# Altium schematic sheet GMSL_DESERIALIZER.SchDoc
size D; SheetNumber: 11; SheetTotal: 22
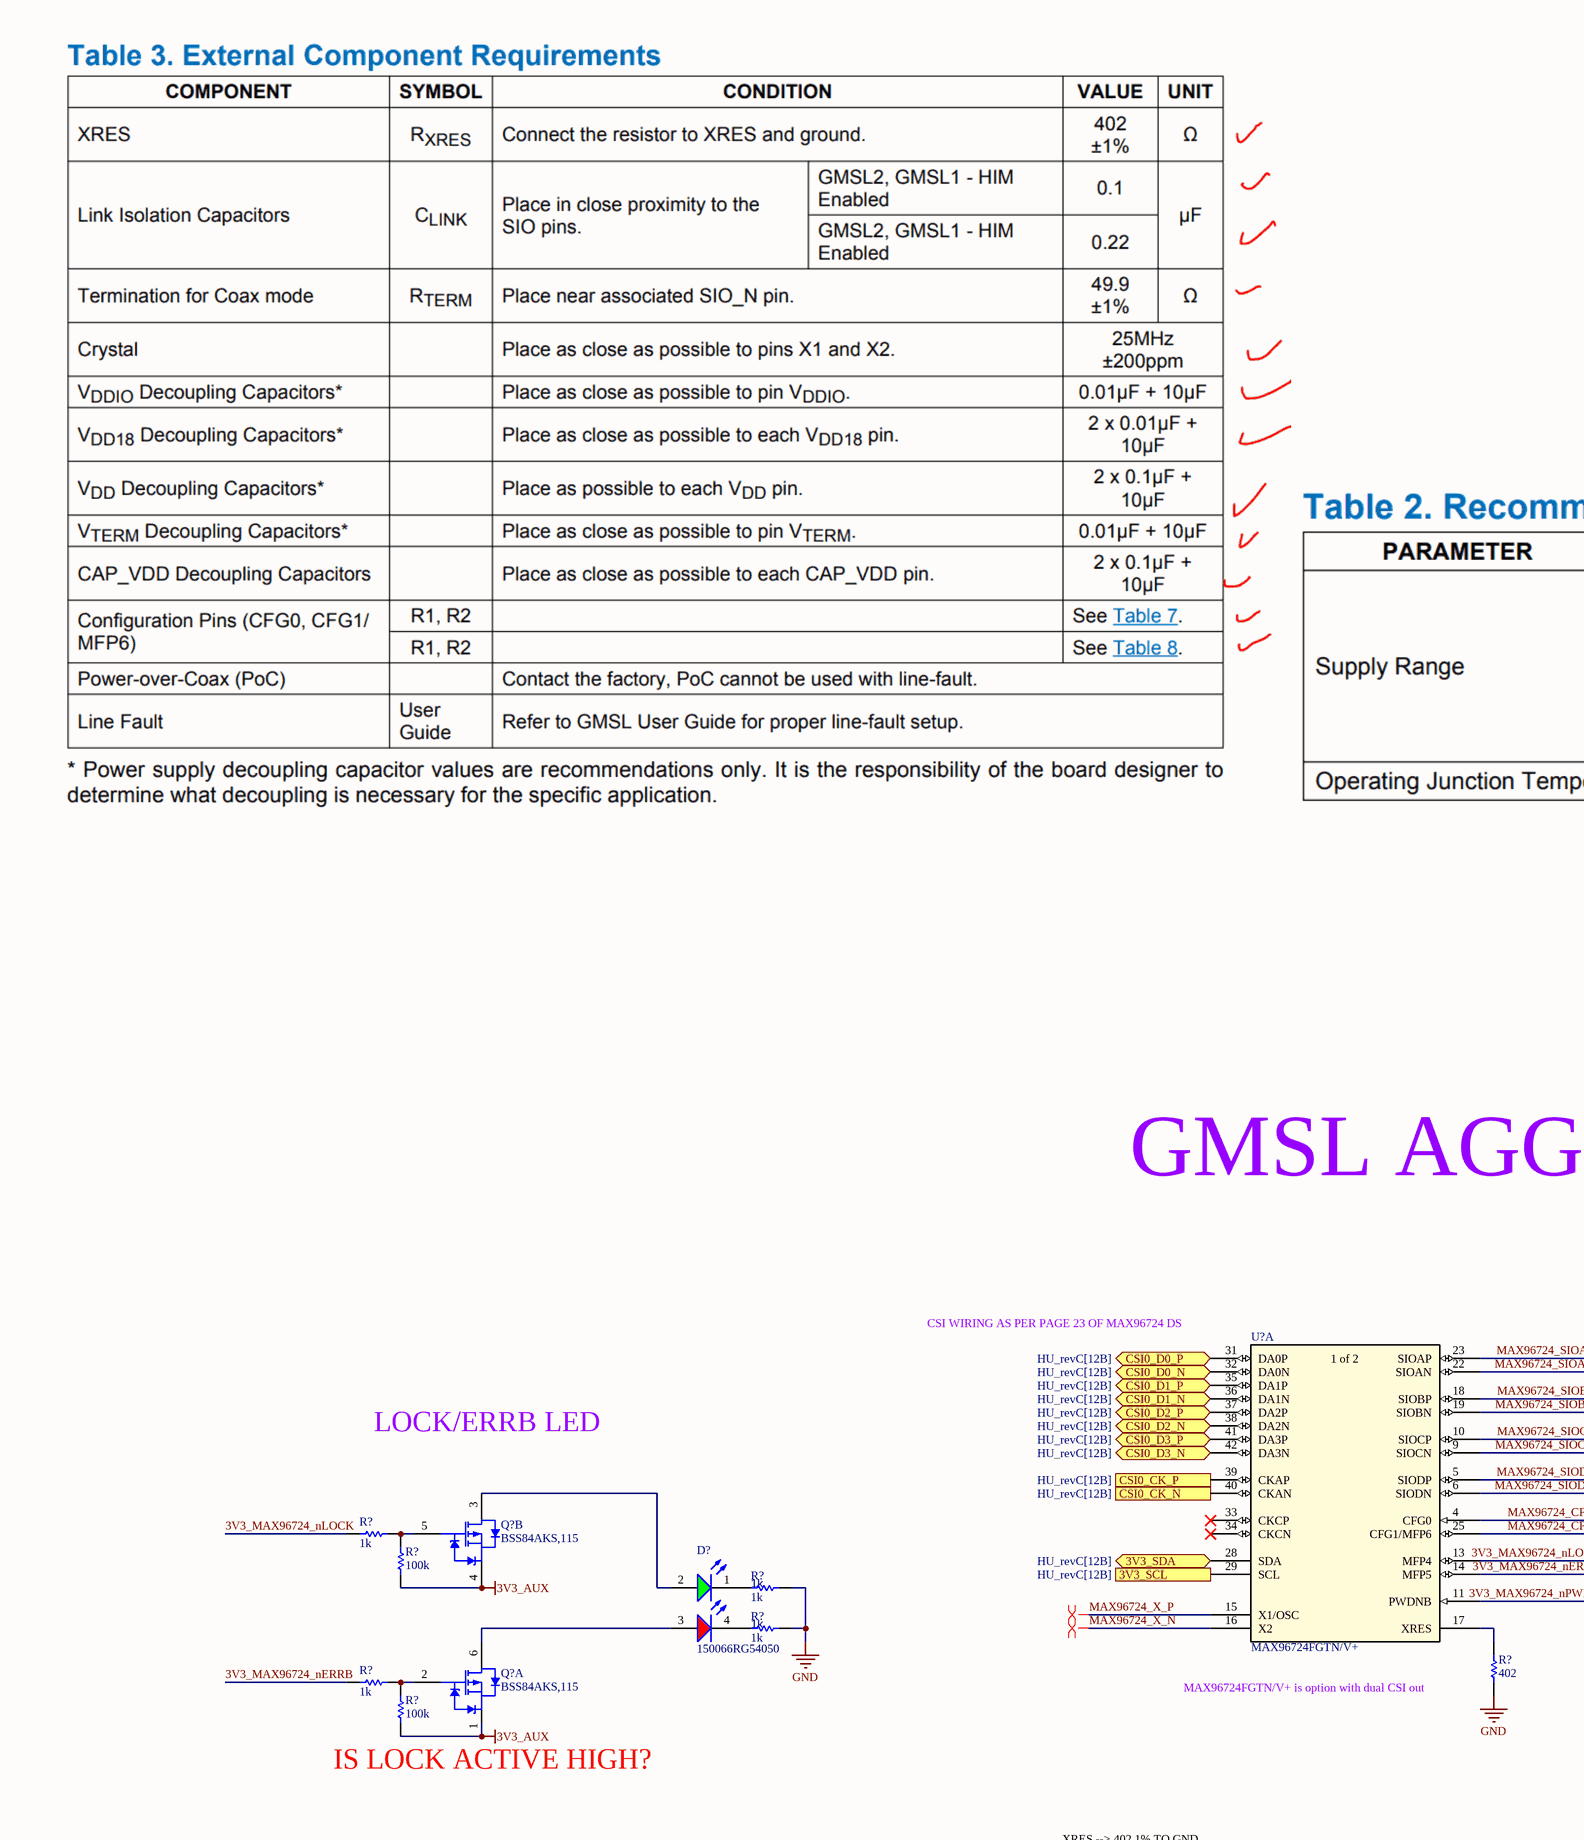
[diagram p0: GMSL_DESERIALIZER.SchDoc, top left]
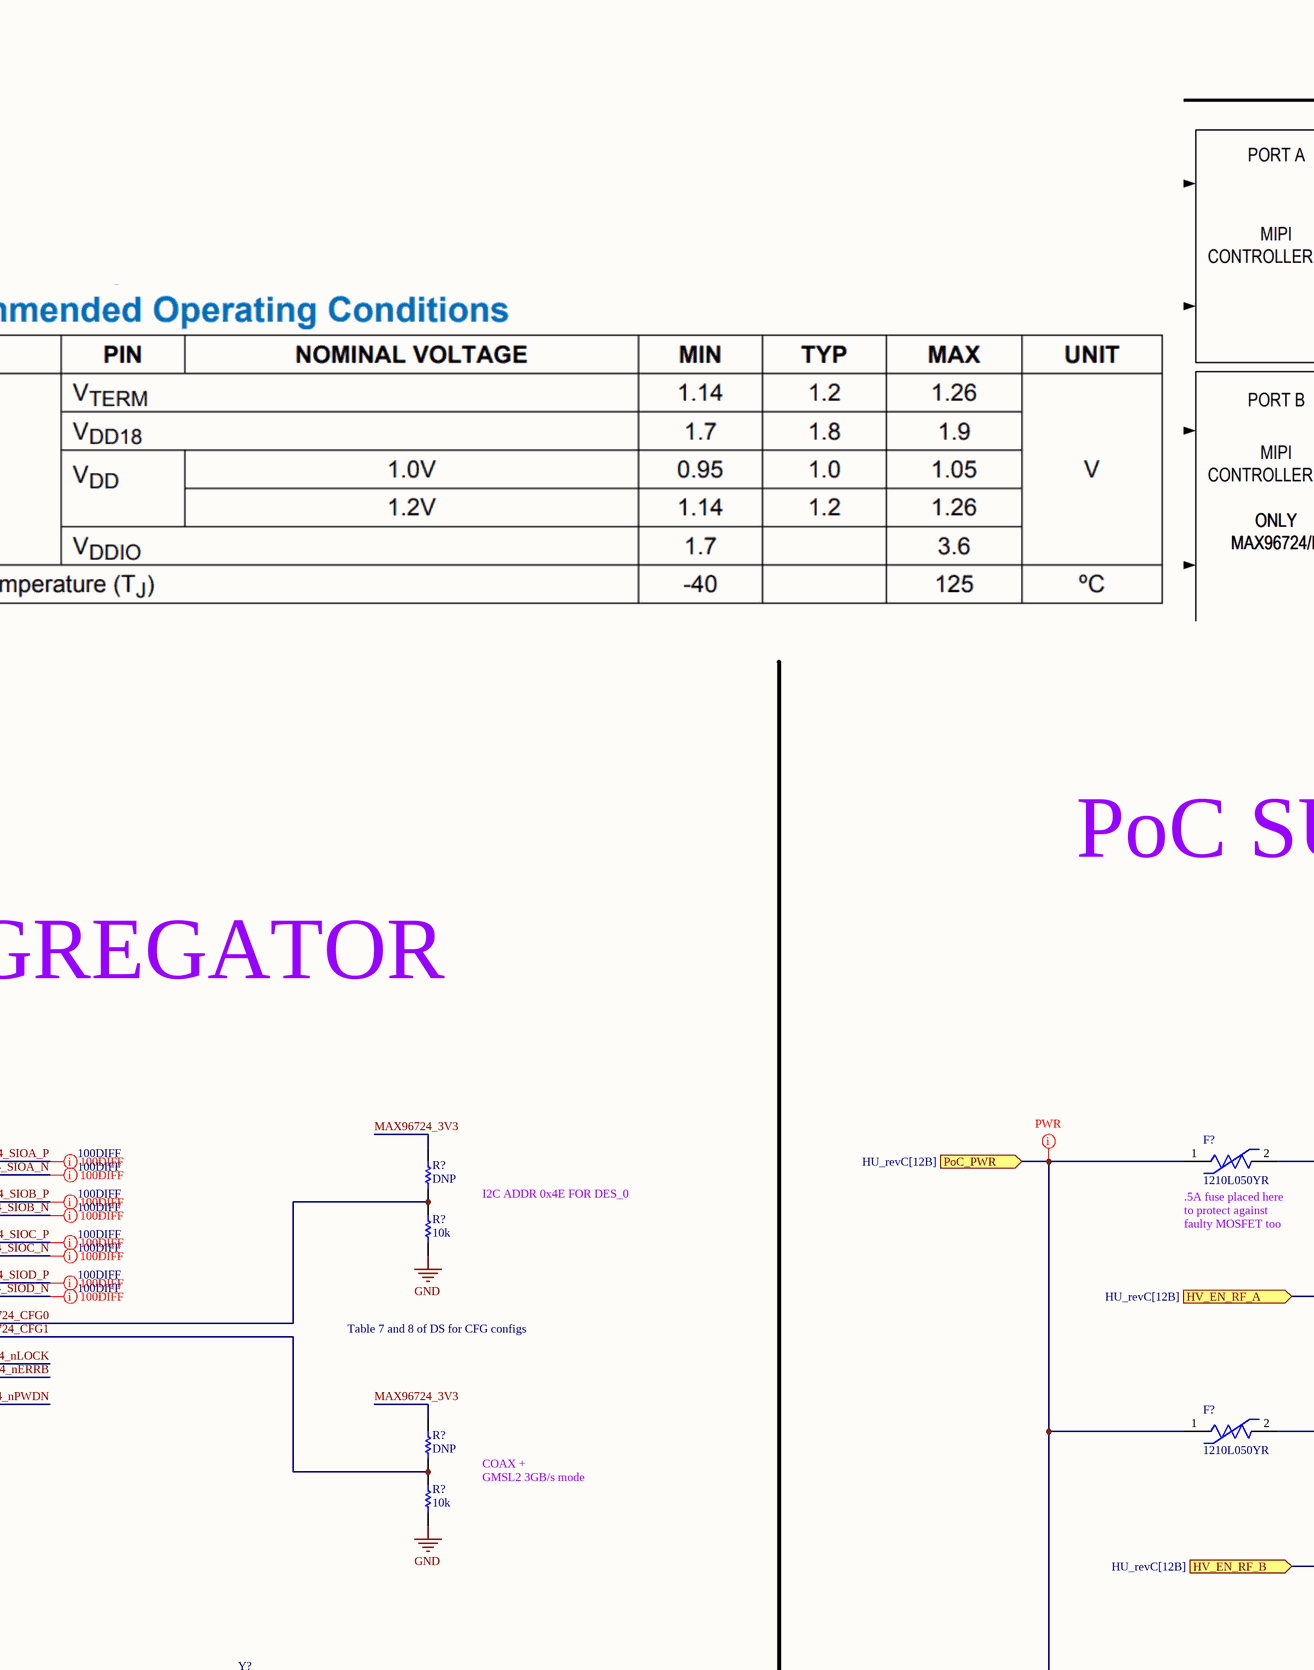
[diagram p1: GMSL_DESERIALIZER.SchDoc, top middle]
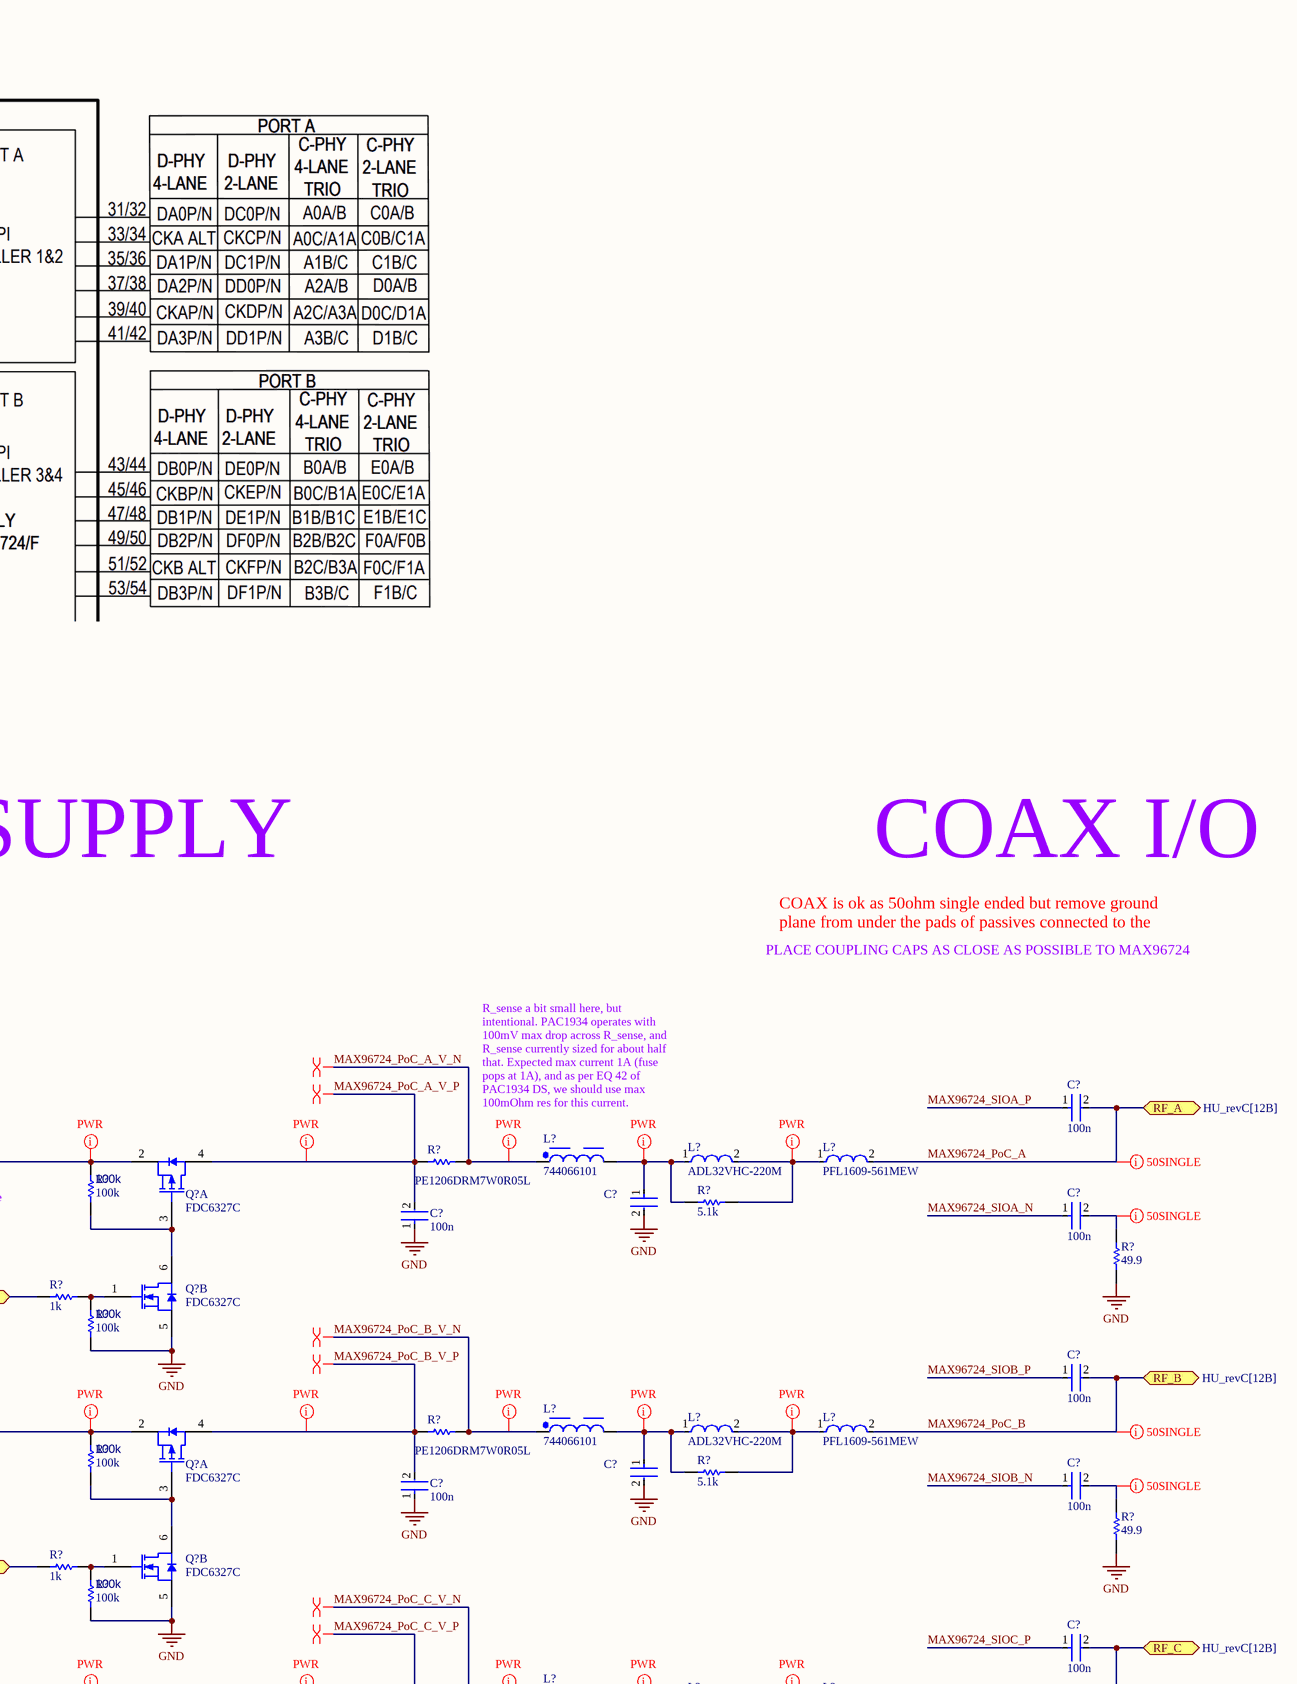
[diagram p2: GMSL_DESERIALIZER.SchDoc, top right]
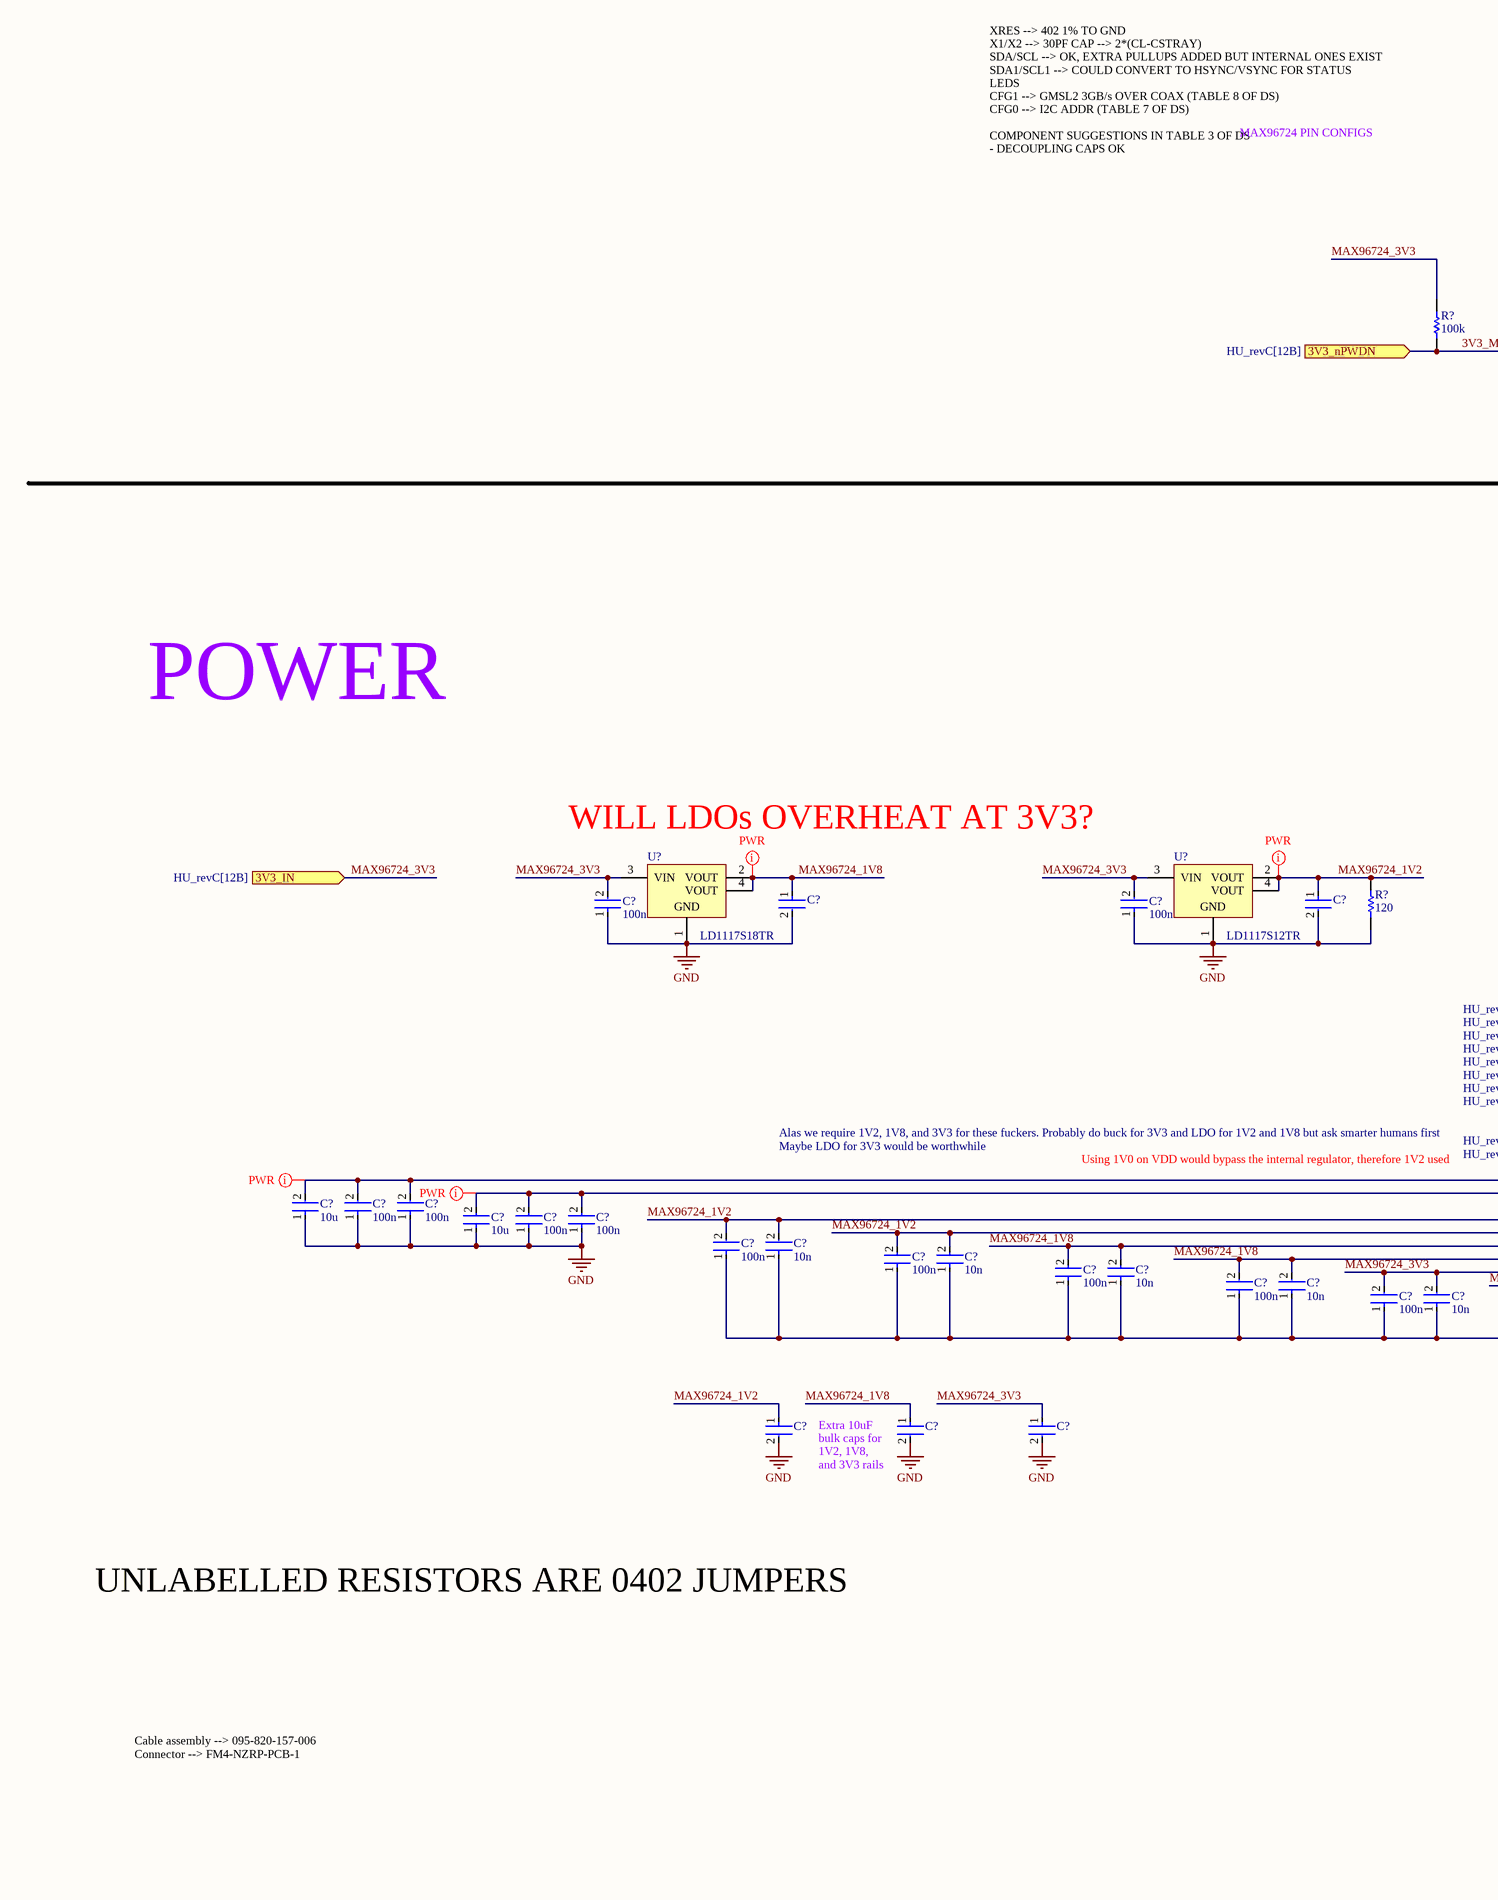
[diagram p3: GMSL_DESERIALIZER.SchDoc, bottom left]
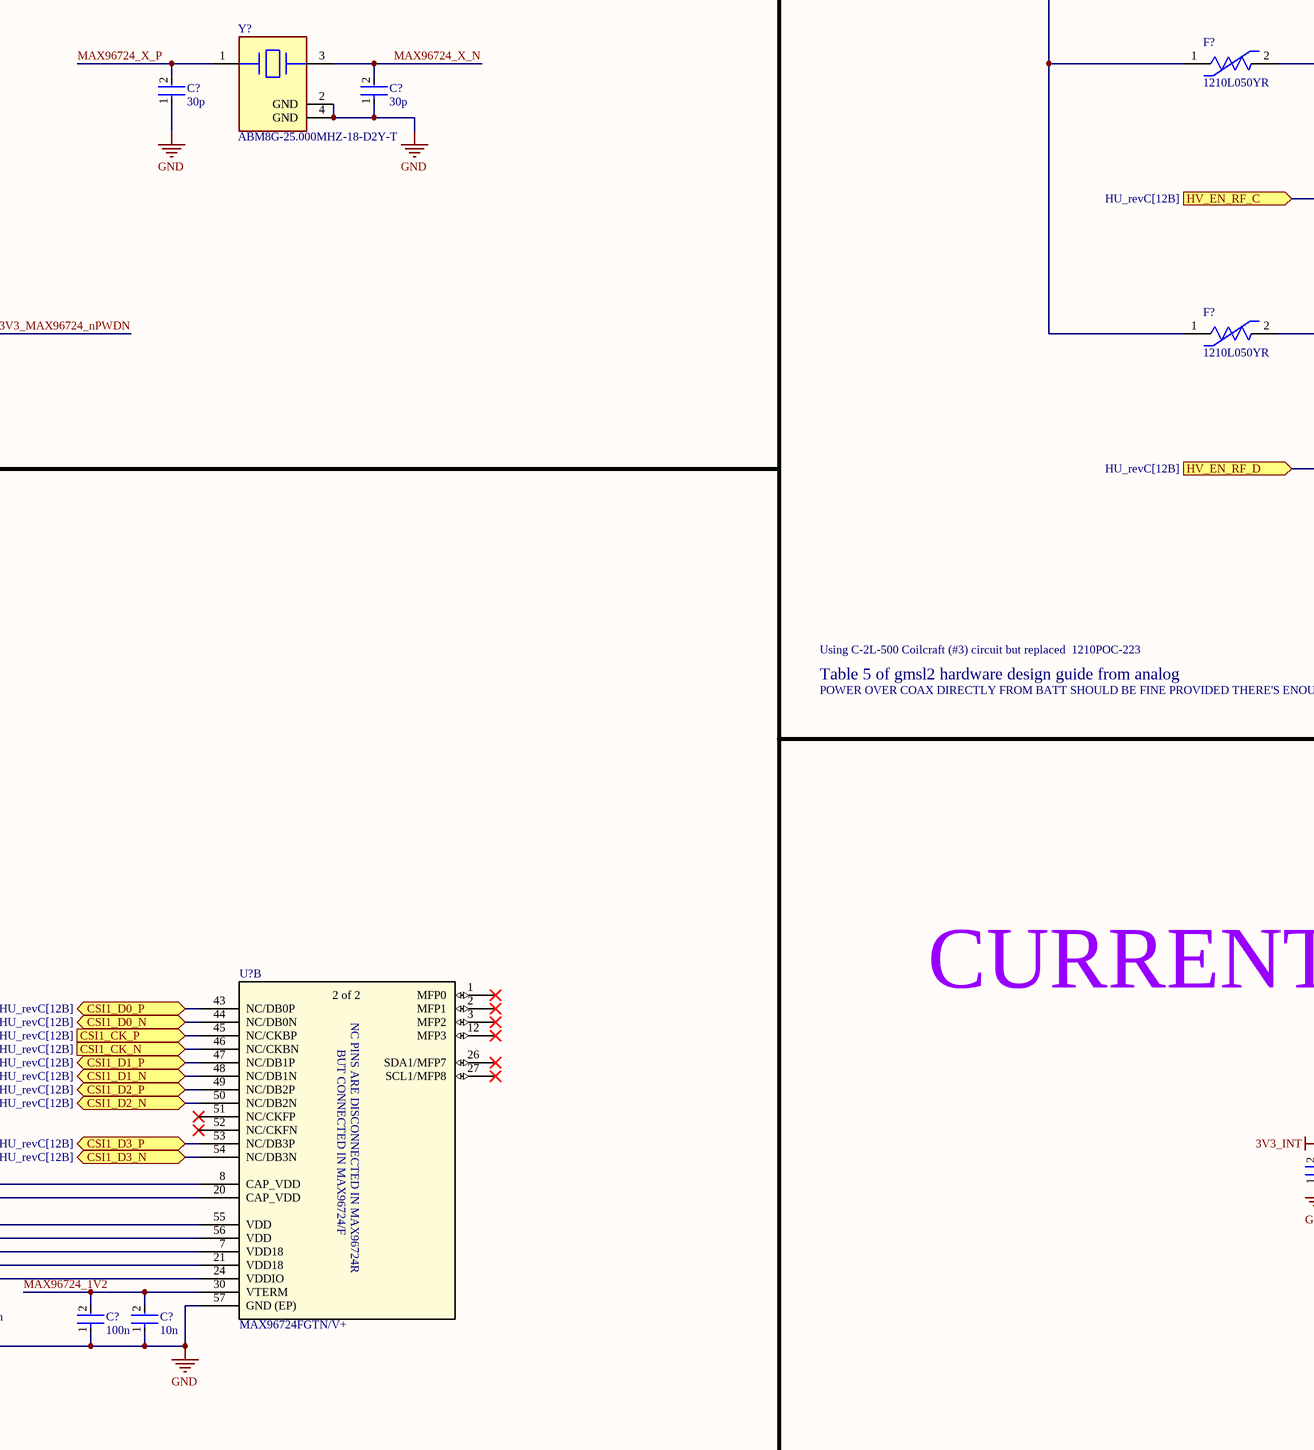
[diagram p4: GMSL_DESERIALIZER.SchDoc, bottom middle]
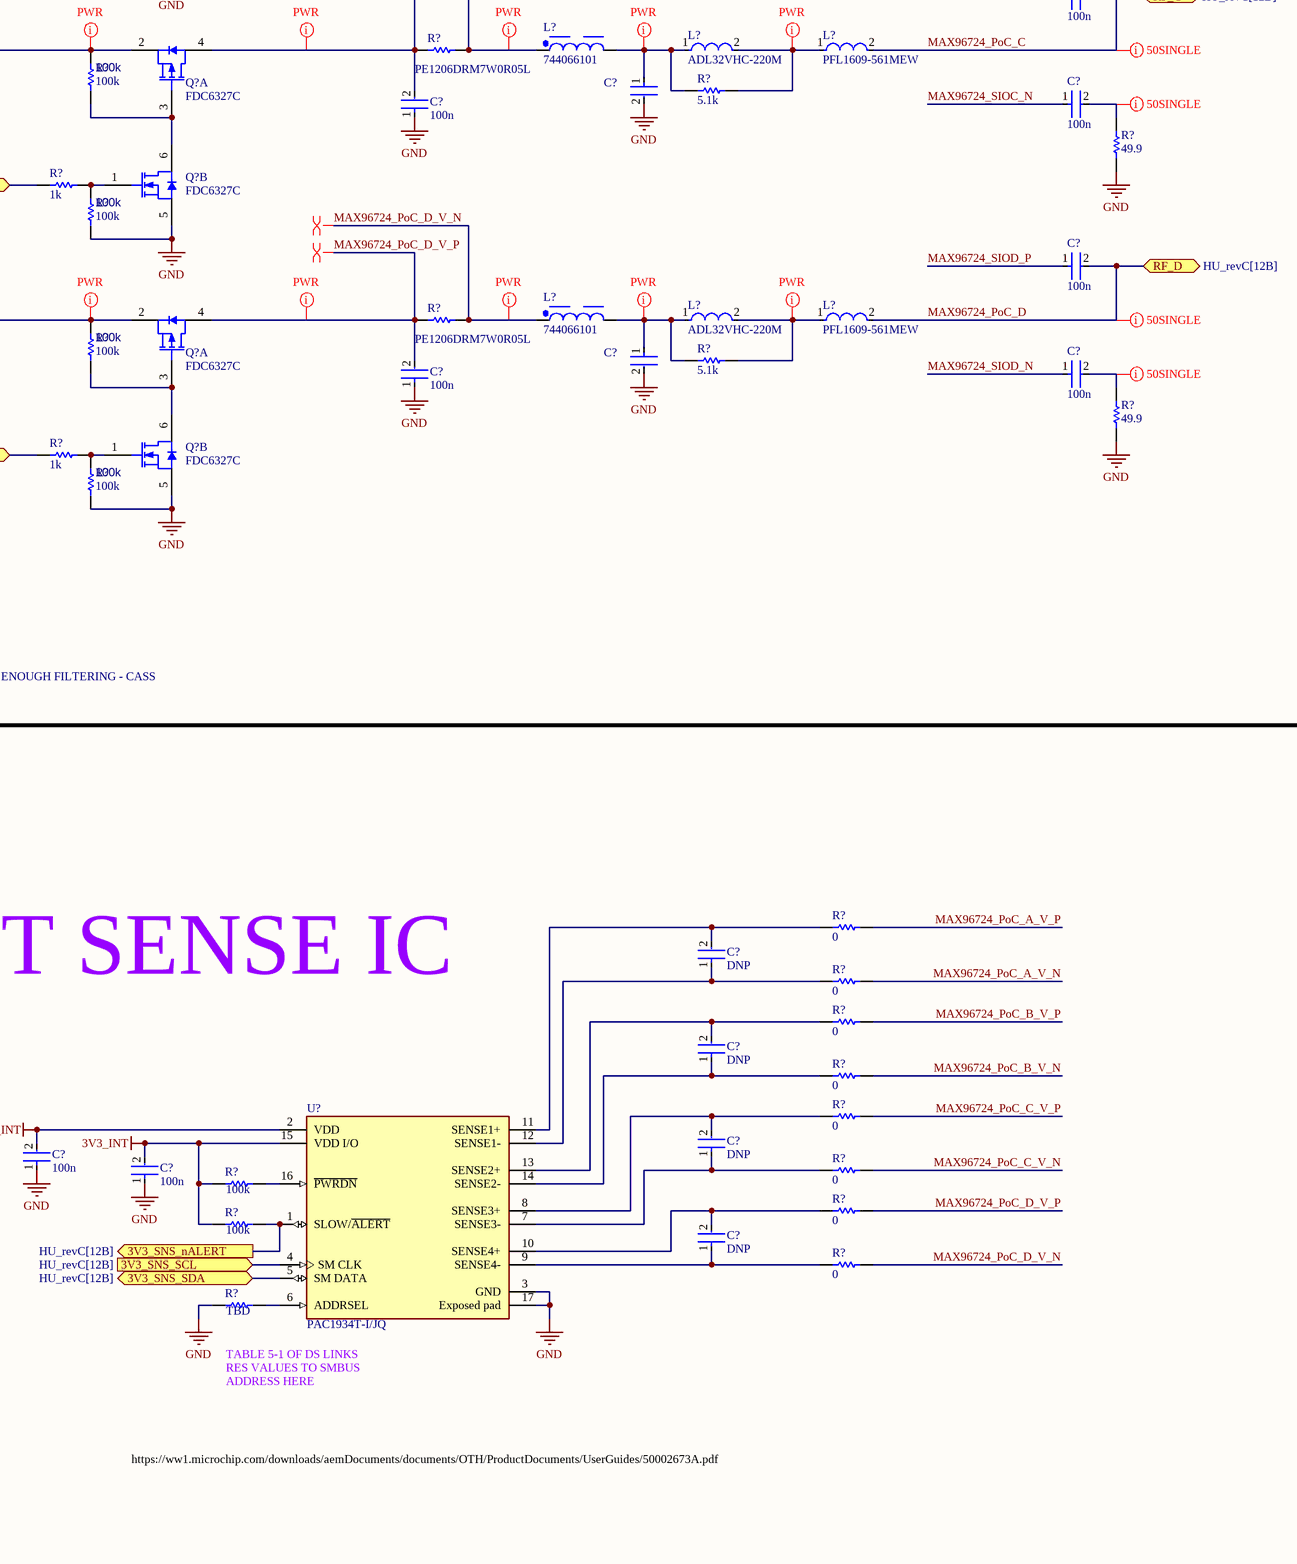
[diagram p5: GMSL_DESERIALIZER.SchDoc, bottom right]

## Parts
(Parts that share a designator on the sheet are numbered #1, #2 ... from top to bottom, then left to right.)
C?#1  100n  [FP-0402-L_1_0_0_05-W_0_5-IPC_A]
C?#2  GRM21BR61E226ME44L  [FP-GRM21B-0_2-e0_2_0_7-IPC_B]  (value not drawn)
C?#3  100n  [FP-0402-L_1_0_0_05-W_0_5-IPC_A]
C?#4  100n  [FP-0402-L_1_0_0_05-W_0_5-IPC_A]
C?#5  100n  [FP-0402-L_1_0_0_05-W_0_5-IPC_A]
C?#6  GRM21BR61E226ME44L  [FP-GRM21B-0_2-e0_2_0_7-IPC_B]  (value not drawn)
C?#7  100n  [FP-0402-L_1_0_0_05-W_0_5-IPC_A]
C?#8  100n  [FP-0402-L_1_0_0_05-W_0_5-IPC_A]
C?#9  100n  [FP-0402-L_1_0_0_05-W_0_5-IPC_A]
C?#10  GRM21BR61E226ME44L  [FP-GRM21B-0_2-e0_2_0_7-IPC_B]  (value not drawn)
C?#11  30p  [FP-0402-L_1_0_0_05-W_0_5-IPC_A]
C?#12  30p  [FP-0402-L_1_0_0_05-W_0_5-IPC_A]
C?#13  100n  [FP-0402-L_1_0_0_05-W_0_5-IPC_A]
C?#14  100n  [FP-0402-L_1_0_0_05-W_0_5-IPC_A]
C?#15  100n  [FP-0402-L_1_0_0_05-W_0_5-IPC_A]
C?#16  GRM21BR61E226ME44L  [FP-GRM21B-0_2-e0_2_0_7-IPC_B]  (value not drawn)
C?#17  100n  [FP-0402-L_1_0_0_05-W_0_5-IPC_A]
C?#18  100n  [FP-0402-L_1_0_0_05-W_0_5-IPC_A]
C?#19  GRM188R60J106ME47D  [FP-GRM188-0_1-e0_2_0_55-IPC_A]  (value not drawn)
C?#20  GRM188R60J106ME47D  [FP-GRM188-0_1-e0_2_0_55-IPC_A]  (value not drawn)
C?#21  100n  [FP-0402-L_1_0_0_05-W_0_5-IPC_A]
C?#22  100n  [FP-0402-L_1_0_0_05-W_0_5-IPC_A]
C?#23  DNP  [FP-0402-L_1_0_0_05-W_0_5-IPC_A]
C?#24  DNP  [FP-0402-L_1_0_0_05-W_0_5-IPC_A]
C?#25  DNP  [FP-0402-L_1_0_0_05-W_0_5-IPC_A]
C?#26  100n  [FP-0402-L_1_0_0_05-W_0_5-IPC_A]
C?#27  100n  [FP-0402-L_1_0_0_05-W_0_5-IPC_A]
C?#28  10u  [FP-0402-L_1_0_0_05-W_0_5-IPC_A]
C?#29  100n  [FP-0402-L_1_0_0_05-W_0_5-IPC_A]
C?#30  100n  [FP-0402-L_1_0_0_05-W_0_5-IPC_A]
C?#31  10u  [FP-0402-L_1_0_0_05-W_0_5-IPC_A]
C?#32  100n  [FP-0402-L_1_0_0_05-W_0_5-IPC_A]
C?#33  100n  [FP-0402-L_1_0_0_05-W_0_5-IPC_A]
C?#34  100n  [FP-0402-L_1_0_0_05-W_0_5-IPC_A]
C?#35  10n  [FP-0402-L_1_0_0_05-W_0_5-IPC_A]
C?#36  DNP  [FP-0402-L_1_0_0_05-W_0_5-IPC_A]
C?#37  100n  [FP-0402-L_1_0_0_05-W_0_5-IPC_A]
C?#38  10n  [FP-0402-L_1_0_0_05-W_0_5-IPC_A]
C?#39  100n  [FP-0402-L_1_0_0_05-W_0_5-IPC_A]
C?#40  10n  [FP-0402-L_1_0_0_05-W_0_5-IPC_A]
C?#41  100n  [FP-0402-L_1_0_0_05-W_0_5-IPC_A]
C?#42  10n  [FP-0402-L_1_0_0_05-W_0_5-IPC_A]
C?#43  100n  [FP-0402-L_1_0_0_05-W_0_5-IPC_A]
C?#44  10n  [FP-0402-L_1_0_0_05-W_0_5-IPC_A]
C?#45  100n  [FP-0402-L_1_0_0_05-W_0_5-IPC_A]
C?#46  10n  [FP-0402-L_1_0_0_05-W_0_5-IPC_A]
C?#47  EMK107BBJ106MA-T  [FP-0603-L_1_6_0_2-W_0_8_0-MFG]  (value not drawn)
C?#48  EMK107BBJ106MA-T  [FP-0603-L_1_6_0_2-W_0_8_0-MFG]  (value not drawn)
C?#49  EMK107BBJ106MA-T  [FP-0603-L_1_6_0_2-W_0_8_0-MFG]  (value not drawn)
D?  150066RG54050  [WL-SBCD_0606]
F?#1  1210L050YR  [FP-1210L050YR-MFG]
F?#2  1210L050YR  [FP-1210L050YR-MFG]
F?#3  1210L050YR  [FP-1210L050YR-MFG]
F?#4  1210L050YR  [FP-1210L050YR-MFG]
L?#1  744066101  [WE-TPC_1038]
L?#2  ADL32VHC-220M  [FP-1210POC-MFG]
L?#3  PFL1609-561MEW  [FP-PFL1609-MFG]
L?#4  744066101  [WE-TPC_1038]
L?#5  ADL32VHC-220M  [FP-1210POC-MFG]
L?#6  PFL1609-561MEW  [FP-PFL1609-MFG]
L?#7  744066101  [WE-TPC_1038]
L?#8  ADL32VHC-220M  [FP-1210POC-MFG]
L?#9  PFL1609-561MEW  [FP-PFL1609-MFG]
L?#10  744066101  [WE-TPC_1038]
L?#11  ADL32VHC-220M  [FP-1210POC-MFG]
L?#12  PFL1609-561MEW  [FP-PFL1609-MFG]
Q?#1  FDC6327C  [FAIR-SOT23-6_V]  (part A of 2)
Q?#2  FDC6327C  [FAIR-SOT23-6_V]  (part B of 2)
Q?#3  BSS84AKS,115  [NXP-SOT363_L]  (part B of 2)
Q?#4  BSS84AKS,115  [NXP-SOT363_L]  (part A of 2)
Q?#5  FDC6327C  [FAIR-SOT23-6_V]  (part A of 2)
Q?#6  FDC6327C  [FAIR-SOT23-6_V]  (part B of 2)
Q?#7  FDC6327C  [FAIR-SOT23-6_V]  (part A of 2)
Q?#8  FDC6327C  [FAIR-SOT23-6_V]  (part B of 2)
Q?#9  FDC6327C  [FAIR-SOT23-6_V]  (part A of 2)
Q?#10  FDC6327C  [FAIR-SOT23-6_V]  (part B of 2)
R?#1  PE1206DRM7W0R05L  [R1206B]
R?#2  DNP  [R0603B]
R?#3  100k  [R0603B]
R?#4  5.1k  [R0603B]
R?#5  10k  [R0603B]
R?#6  49.9  [R0603B]
R?#7  1k  [R0603B]
R?#8  100k  [R0603B]
R?#9  1k  [R0603B]
R?#10  100k  [R0603B]
R?#11  1k  [R0603B]
R?#12  1k  [R0603B]
R?#13  PE1206DRM7W0R05L  [R1206B]
R?#14  DNP  [R0603B]
R?#15  100k  [R0603B]
R?#16  402  [R0603B]
R?#17  5.1k  [R0603B]
R?#18  1k  [R0603B]
R?#19  10k  [R0603B]
R?#20  100k  [R0603B]
R?#21  49.9  [R0603B]
R?#22  1k  [R0603B]
R?#23  100k  [R0603B]
R?#24  PE1206DRM7W0R05L  [R1206B]
R?#25  100k  [R0603B]
R?#26  5.1k  [R0603B]
R?#27  49.9  [R0603B]
R?#28  1k  [R0603B]
R?#29  100k  [R0603B]
R?#30  100k  [R0603B]
R?#31  PE1206DRM7W0R05L  [R1206B]
R?#32  100k  [R0603B]
R?#33  5.1k  [R0603B]
R?#34  49.9  [R0603B]
R?#35  1k  [R0603B]
R?#36  100k  [R0603B]
R?#37  120  [R0603B]
R?#38  0  [R0603B]
R?#39  0  [R0603B]
R?#40  0  [R0603B]
R?#41  0  [R0603B]
R?#42  0  [R0603B]
R?#43  0  [R0603B]
R?#44  100k  [R0603B]
R?#45  0  [R0603B]
R?#46  100k  [R0603B]
R?#47  0  [R0603B]
R?#48  TBD  [R0603B]
U?#1  MAX96724FGTN/V+  [MAX96724FGTN_V+-Footprint-1]  (part A of 2)
U?#2  LD1117S18TR  [SOT-223_M]
U?#3  LD1117S12TR  [SOT-223_M]
U?#4  MAX96724FGTN/V+  [MAX96724FGTN_V+-Footprint-1]  (part B of 2)
U?#5  PAC1934T-I/JQ  [FP-C04-257-MFG]
Y?  ABM8G-25.000MHZ-18-D2Y-T  [FP-ABM8G-MFG]

## Ports
3V3_IN (in, see HU_revC[12B]), 3V3_nPWDN (in, see HU_revC[12B]), 3V3_SCL (in, see HU_revC[12B]), 3V3_SDA (bidir, see HU_revC[12B]), 3V3_SNS_nALERT (out, see HU_revC[12B]), 3V3_SNS_SCL (in, see HU_revC[12B]), 3V3_SNS_SDA (bidir, see HU_revC[12B]), CSI0_CK_N (in, see HU_revC[12B]), CSI0_CK_P (in, see HU_revC[12B]), CSI0_D0_N (bidir, see HU_revC[12B]), CSI0_D0_P (bidir, see HU_revC[12B]), CSI0_D1_N (bidir, see HU_revC[12B]), CSI0_D1_P (bidir, see HU_revC[12B]), CSI0_D2_N (bidir, see HU_revC[12B]), CSI0_D2_P (bidir, see HU_revC[12B]), CSI0_D3_N (bidir, see HU_revC[12B]), CSI0_D3_P (bidir, see HU_revC[12B]), CSI1_CK_N (in, see HU_revC[12B]), CSI1_CK_P (in, see HU_revC[12B]), CSI1_D0_N (bidir, see HU_revC[12B]), CSI1_D0_P (bidir, see HU_revC[12B]), CSI1_D1_N (bidir, see HU_revC[12B]), CSI1_D1_P (bidir, see HU_revC[12B]), CSI1_D2_N (bidir, see HU_revC[12B]), CSI1_D2_P (bidir, see HU_revC[12B]), CSI1_D3_N (bidir, see HU_revC[12B]), CSI1_D3_P (bidir, see HU_revC[12B]), HV_EN_RF_A (in, see HU_revC[12B]), HV_EN_RF_B (in, see HU_revC[12B]), HV_EN_RF_C (in, see HU_revC[12B]), HV_EN_RF_D (in, see HU_revC[12B]), PoC_PWR (in, see HU_revC[12B]), RF_A (bidir, see HU_revC[12B]), RF_B (bidir, see HU_revC[12B]), RF_C (bidir, see HU_revC[12B]), RF_D (bidir, see HU_revC[12B])

## Nets
3V3_AUX: Q?#3.4(S2) Q?#4.1(S1) R?#10.2 R?#20.1
3V3_INT: C?#26.2 C?#27.2 R?#44.2 R?#46.2 U?#5.2(VDD) U?#5.15(VDD_I/O)
GND: C?#2.2 C?#4.1 C?#6.2 C?#8.1 C?#10.2 C?#11.1 C?#12.1 C?#14.1 C?#16.2 C?#18.1 C?#19.2 C?#20.2 C?#21.1 C?#22.1 C?#26.1 C?#27.1 C?#28.1 C?#29.1 C?#30.1 C?#31.1 C?#32.1 C?#33.1 C?#34.1 C?#35.1 C?#37.1 C?#38.1 C?#39.1 C?#40.1 C?#41.1 C?#42.1 C?#43.1 C?#44.1 C?#45.1 C?#46.1 C?#47.2 C?#48.2 C?#49.2 Q?#2.5(S) Q?#6.5(S) Q?#8.5(S) Q?#10.5(S) R?#5.1 R?#6.1 R?#8.1 R?#11.1 R?#12.1 R?#16.1 R?#19.1 R?#21.1 R?#23.1 R?#27.1 R?#29.1 R?#34.1 R?#36.1 R?#37.1 R?#48.2 U?#2.1(GND) U?#3.1(GND) U?#4.57(GND_(EP)) U?#5.3(GND) U?#5.17(Exposed_pad) Y?.2(GND) Y?.4(GND)
3V3_MAX96724_nERRB: R?#18.1 U?#1.14(MFP5)
3V3_MAX96724_nLOCK: R?#9.2 U?#1.13(MFP4)
3V3_MAX96724_nPWDN: R?#30.1 U?#1.11(PWDNB) ; port 3V3_nPWDN
3V3_SCL: U?#1.29(SCL) ; port 3V3_SCL
3V3_SDA: U?#1.28(SDA) ; port 3V3_SDA
3V3_SNS_nALERT: R?#46.1 U?#5.1(SLOW/~{ALERT}) ; port 3V3_SNS_nALERT
3V3_SNS_SCL: U?#5.4(SM_CLK) ; port 3V3_SNS_SCL
3V3_SNS_SDA: U?#5.5(SM_DATA) ; port 3V3_SNS_SDA
CSI0_CK_N: U?#1.40(CKAN) ; port CSI0_CK_N
CSI0_CK_P: U?#1.39(CKAP) ; port CSI0_CK_P
CSI0_D0_N: U?#1.32(DA0N) ; port CSI0_D0_N
CSI0_D0_P: U?#1.31(DA0P) ; port CSI0_D0_P
CSI0_D1_N: U?#1.36(DA1N) ; port CSI0_D1_N
CSI0_D1_P: U?#1.35(DA1P) ; port CSI0_D1_P
CSI0_D2_N: U?#1.38(DA2N) ; port CSI0_D2_N
CSI0_D2_P: U?#1.37(DA2P) ; port CSI0_D2_P
CSI0_D3_N: U?#1.42(DA3N) ; port CSI0_D3_N
CSI0_D3_P: U?#1.41(DA3P) ; port CSI0_D3_P
CSI1_CK_N: U?#4.46(NC/CKBN) ; port CSI1_CK_N
CSI1_CK_P: U?#4.45(NC/CKBP) ; port CSI1_CK_P
CSI1_D0_N: U?#4.44(NC/DB0N) ; port CSI1_D0_N
CSI1_D0_P: U?#4.43(NC/DB0P) ; port CSI1_D0_P
CSI1_D1_N: U?#4.48(NC/DB1N) ; port CSI1_D1_N
CSI1_D1_P: U?#4.47(NC/DB1P) ; port CSI1_D1_P
CSI1_D2_N: U?#4.50(NC/DB2N) ; port CSI1_D2_N
CSI1_D2_P: U?#4.49(NC/DB2P) ; port CSI1_D2_P
CSI1_D3_N: U?#4.54(NC/DB3N) ; port CSI1_D3_N
CSI1_D3_P: U?#4.53(NC/DB3P) ; port CSI1_D3_P
HV_EN_RF_A: R?#7.2 ; port HV_EN_RF_A
HV_EN_RF_B: R?#22.2 ; port HV_EN_RF_B
HV_EN_RF_C: R?#28.2 ; port HV_EN_RF_C
HV_EN_RF_D: R?#35.2 ; port HV_EN_RF_D
MAX96724_1V2: C?#20.1 C?#34.2 C?#35.2 C?#37.2 C?#38.2 C?#45.2 C?#46.2 C?#47.1 R?#37.2 U?#3.2(VOUT) U?#3.4(VOUT) U?#4.30(VTERM) U?#4.55(VDD) U?#4.56(VDD)
MAX96724_1V8: C?#19.1 C?#39.2 C?#40.2 C?#41.2 C?#42.2 C?#48.1 U?#2.2(VOUT) U?#2.4(VOUT) U?#4.7(VDD18) U?#4.21(VDD18)
MAX96724_3V3: C?#21.2 C?#22.2 C?#43.2 C?#44.2 C?#49.1 R?#2.2 R?#14.2 R?#30.2 U?#2.3(VIN) U?#3.3(VIN) U?#4.24(VDDIO) ; port 3V3_IN
MAX96724_CFG0: R?#2.1 R?#5.2 U?#1.4(CFG0)
MAX96724_CFG1: R?#14.1 R?#19.2 U?#1.25(CFG1/MFP6)
MAX96724_PoC_A: C?#1.2 L?#3.2 ; port RF_A
MAX96724_PoC_A_V_N: L?#1.1 R?#1.1 R?#39.1
MAX96724_PoC_A_V_P: C?#4.2 Q?#1.4(D) R?#1.2 R?#38.1
MAX96724_PoC_B: C?#5.2 L?#6.2 ; port RF_B
MAX96724_PoC_B_V_N: L?#4.1 R?#13.1 R?#41.1
MAX96724_PoC_B_V_P: C?#8.2 Q?#5.4(D) R?#13.2 R?#40.1
MAX96724_PoC_C: C?#9.2 L?#9.2 ; port RF_C
MAX96724_PoC_C_V_N: L?#7.1 R?#24.1 R?#43.1
MAX96724_PoC_C_V_P: C?#14.2 Q?#7.4(D) R?#24.2 R?#42.1
MAX96724_PoC_D: C?#15.2 L?#12.2 ; port RF_D
MAX96724_PoC_D_V_N: L?#10.1 R?#31.1 R?#47.1
MAX96724_PoC_D_V_P: C?#18.2 Q?#9.4(D) R?#31.2 R?#45.1
MAX96724_SIOA_N: C?#3.1 U?#1.22(SIOAN)
MAX96724_SIOA_P: C?#1.1 U?#1.23(SIOAP)
MAX96724_SIOB_N: C?#7.1 U?#1.19(SIOBN)
MAX96724_SIOB_P: C?#5.1 U?#1.18(SIOBP)
MAX96724_SIOC_N: C?#13.1 U?#1.9(SIOCN)
MAX96724_SIOC_P: C?#9.1 U?#1.10(SIOCP)
MAX96724_SIOD_N: C?#17.1 U?#1.6(SIODN)
MAX96724_SIOD_P: C?#15.1 U?#1.5(SIODP)
MAX96724_X_N: C?#12.2 U?#1.16(X2) Y?.3
MAX96724_X_P: C?#11.2 U?#1.15(X1/OSC) Y?.1
PoC_PWR: F?#1.1 F?#2.1 F?#3.1 F?#4.1 ; port PoC_PWR
NetC?#2_1: C?#2.1 L?#1.2 L?#2.1 R?#4.2
NetC?#3_2: C?#3.2 R?#6.2
NetC?#6_1: C?#6.1 L?#4.2 L?#5.1 R?#17.2
NetC?#7_2: C?#7.2 R?#21.2
NetC?#10_1: C?#10.1 L?#7.2 L?#8.1 R?#26.2
NetC?#13_2: C?#13.2 R?#27.2
NetC?#16_1: C?#16.1 L?#10.2 L?#11.1 R?#33.2
NetC?#17_2: C?#17.2 R?#34.2
NetC?#23_1: C?#23.1 R?#39.2 U?#5.12(SENSE1-)
NetC?#23_2: C?#23.2 R?#38.2 U?#5.11(SENSE1+)
NetC?#24_1: C?#24.1 R?#41.2 U?#5.14(SENSE2-)
NetC?#24_2: C?#24.2 R?#40.2 U?#5.13(SENSE2+)
NetC?#25_1: C?#25.1 R?#43.2 U?#5.7(SENSE3-)
NetC?#25_2: C?#25.2 R?#42.2 U?#5.8(SENSE3+)
NetC?#28_2: C?#28.2 C?#29.2 C?#30.2 U?#4.8(CAP_VDD)
NetC?#31_2: C?#31.2 C?#32.2 C?#33.2 U?#4.20(CAP_VDD)
NetC?#36_1: C?#36.1 R?#47.2 U?#5.9(SENSE4-)
NetC?#36_2: C?#36.2 R?#45.2 U?#5.10(SENSE4+)
NetD?_1: D?.1(K) R?#11.2
NetD?_2: D?.2(A) Q?#3.3(D2)
NetD?_3: D?.3(A) Q?#4.6(D1)
NetD?_4: D?.4(K) R?#12.2
NetF?#1_2: F?#1.2 Q?#1.2(S) R?#3.2
NetF?#2_2: F?#2.2 Q?#5.2(S) R?#15.2
NetF?#3_2: F?#3.2 Q?#7.2(S) R?#25.2
NetF?#4_2: F?#4.2 Q?#9.2(S) R?#32.2
NetL?#2_2: L?#2.2 L?#3.1 R?#4.1
NetL?#5_2: L?#5.2 L?#6.1 R?#17.1
NetL?#8_2: L?#8.2 L?#9.1 R?#26.1
NetL?#11_2: L?#11.2 L?#12.1 R?#33.1
NetQ?#1_3: Q?#1.3(G) Q?#2.6(D) R?#3.1
NetQ?#2_1: Q?#2.1(G) R?#7.1 R?#8.2
NetQ?#3_5: Q?#3.5(G2) R?#9.1 R?#10.1
NetQ?#4_2: Q?#4.2(G1) R?#18.2 R?#20.2
NetQ?#5_3: Q?#5.3(G) Q?#6.6(D) R?#15.1
NetQ?#6_1: Q?#6.1(G) R?#22.1 R?#23.2
NetQ?#7_3: Q?#7.3(G) Q?#8.6(D) R?#25.1
NetQ?#8_1: Q?#8.1(G) R?#28.1 R?#29.2
NetQ?#9_3: Q?#9.3(G) Q?#10.6(D) R?#32.1
NetQ?#10_1: Q?#10.1(G) R?#35.1 R?#36.2
NetR?#16_2: R?#16.2 U?#1.17(XRES)
NetR?#44_1: R?#44.1 U?#5.16(~{PWRDN})
NetR?#48_1: R?#48.1 U?#5.6(ADDRSEL)

Not connected (* = marked no-connect by the designer): U?#1 33(CKCP)* 34(CKCN)*; U?#4 1(MFP0)* 2(MFP1)* 3(MFP2)* 12(MFP3)* 26(SDA1/MFP7)* 27(SCL1/MFP8)* 51(NC/CKFP)* 52(NC/CKFN)*

## Layout directives
net class 50SINGLE: MAX96724_PoC_A, MAX96724_PoC_B, MAX96724_PoC_C, MAX96724_PoC_D, NetC?#3_2, NetC?#7_2, NetC?#13_2, NetC?#17_2
differential pair: MAX96724_PoC_A_V_N, MAX96724_PoC_A_V_P, MAX96724_PoC_B_V_N, MAX96724_PoC_B_V_P, MAX96724_PoC_C_V_N, MAX96724_PoC_C_V_P, MAX96724_PoC_D_V_N, MAX96724_PoC_D_V_P, MAX96724_X_N, MAX96724_X_P
net class PWR: MAX96724_1V2, MAX96724_1V8, MAX96724_PoC_A_V_N, MAX96724_PoC_A_V_P, MAX96724_PoC_B_V_N, MAX96724_PoC_B_V_P, MAX96724_PoC_C_V_N, MAX96724_PoC_C_V_P, MAX96724_PoC_D_V_N, MAX96724_PoC_D_V_P, NetC?#2_1, NetC?#6_1, NetC?#10_1, NetC?#16_1, NetC?#28_2, NetC?#31_2, NetF?#1_2, NetF?#2_2, NetF?#3_2, NetF?#4_2, NetL?#2_2, NetL?#5_2, NetL?#8_2, NetL?#11_2, PoC_PWR
differential pair; differential pair class 100DIFF: MAX96724_SIOA_N, MAX96724_SIOA_P, MAX96724_SIOB_N, MAX96724_SIOB_P, MAX96724_SIOC_N, MAX96724_SIOC_P, MAX96724_SIOD_N, MAX96724_SIOD_P

## Notes on the sheet
- PoC SUPPLY
- COAX I/O
- PLACE COUPLING CAPS AS CLOSE AS POSSIBLE TO MAX96724
- COAX is ok as 50ohm single ended but remove ground plane from under the pads of passives connected to the GMSL trace
- GMSL AGGREGATOR
- R_sense a bit small here, but intentional. PAC1934 operates with 100mV max drop across R_sense, and R_sense currently sized for about half that. Expected max current 1A (fuse pops at 1A), and as per EQ 42 of PAC1934 DS, we should use max 100mOhm res for this current.
- CSI WIRING AS PER PAGE 23 OF MAX96724 DS
- LOCK/ERRB LED
- I2C ADDR 0x4E FOR DES_0
- (near F?#1) .5A fuse placed here to protect against faulty MOSFET too
- Table 7 and 8 of DS for CFG configs
- MAX96724FGTN/V+ is option with dual CSI out
- GMSL2 3GB/s mode
- COAX +
- IS LOCK ACTIVE HIGH?
- XRES --> 402 1% TO GND
  X1/X2 --> 30PF CAP --> 2*(CL-CSTRAY)
  SDA/SCL --> OK, EXTRA PULLUPS ADDED BUT INTERNAL ONES EXIST
  SDA1/SCL1 --> COULD CONVERT TO HSYNC/VSYNC FOR STATUS LEDS
  CFG1 --> GMSL2 3GB/s OVER COAX (TABLE 8 OF DS)
  CFG0 --> I2C ADDR (TABLE 7 OF DS)
  COMPONENT SUGGESTIONS IN TABLE 3 OF DS
  - DECOUPLING CAPS OK
- MAX96724 PIN CONFIGS
- Table 5 of gmsl2 hardware design guide from analog
- POWER OVER COAX DIRECTLY FROM BATT SHOULD BE FINE PROVIDED THERE'S ENOUGH FILTERING - CASS
- Using C-2L-500 Coilcraft (#3) circuit but replaced  1210POC-223
- POWER
- WILL LDOs OVERHEAT AT 3V3?
- CURRENT SENSE IC
- Alas we require 1V2, 1V8, and 3V3 for these fuckers. Probably do buck for 3V3 and LDO for 1V2 and 1V8 but ask smarter humans first
- Maybe LDO for 3V3 would be worthwhile
- Using 1V0 on VDD would bypass the internal regulator, therefore 1V2 used
- TABLE 5-1 OF DS LINKS RES VALUES TO SMBUS ADDRESS HERE
- (near C?#48) Extra 10uF bulk caps for 1V2, 1V8, and 3V3 rails
- https://ww1.microchip.com/downloads/aemDocuments/documents/OTH/ProductDocuments/UserGuides/50002673A.pdf
- UNLABELLED RESISTORS ARE 0402 JUMPERS
- Cable assembly --> 095-820-157-006
  Connector --> FM4-NZRP-PCB-1
- (in symbol CMP-015-00011-4, part A) 1 of 2
- (in symbol CMP-015-00011-4, part B) 2 of 2; NC PINS ARE DISCONNECTED IN MAX96724R; BUT CONNECTED IN MAX96724/F

## Library data of the parts
C?#1 C?#3-C?#5 C?#7-C?#9 C?#11-C?#15 C?#17 C?#18 C?#21-C?#46 = CMP-001-00058-1: LARGE PADS, 0402 CAP, CHANGE COMMENT TO MATCH REAL P/N; Capacitor Type: Ceramic; Min Operating Temperature: -55°C; Mounting Technology: Surface Mount; Pins: 2; Case/Package: 0402; RoHS Compliant: Yes; Max Operating Temperature: 85°C
C?#2 C?#6 C?#10 C?#16 = CMP-2007-03222-3: Chip Multilayer Ceramic Capacitors for General Purpose, 0805, 22uF, X5R, 15%, 20%, 25V; Case/Package: 0805; Depth: 1.25mm; Resistor Type: Ceramic; Voltage Rating: 25V; Lead Free: Lead Free; Voltage Rating (DC): 25V; Case Code (Metric): 2012; Thickness: 0.057inch; REACH SVHC: No SVHC; Material: Ceramic; Tolerance: 20%; Length: 2mm; Capacitance: 22uF; Case Code (Imperial): 0805; Max Operating Temperature: 85°C; Termination: SMD/SMT; Weight: 0.000335oz; Dielectric: X5R; Packaging: Tape and Reel; Voltage: 25V; Package Quantity: 3000; Height: 1.25mm; Mount: Surface Mount; Width: 1.25mm; Min Operating Temperature: -55°C
C?#19 C?#20 = CMP-2006-02792-2: Chip Multilayer Ceramic Capacitors for General Purpose, 0603, 10uF, X5R, 15%, 20%, 6.3V; Packaging: Tape and Reel; Voltage Rating (DC): 6.3V; Width: 0.031inch; Termination: SMD/SMT; Dielectric: X5R; Package Quantity: 4000; Voltage Rating: 6.3V; Capacitance: 10uF; Case/Package: 0603; Min Operating Temperature: -55°C; Voltage: 6.3V; Length: 1.6mm; Thickness: 0.035inch; Lead Free: Lead Free; Depth: 0.8mm; Case Code (Imperial): 0603; Max Operating Temperature: 85°C; Material: Ceramic; Height: 0.8mm; Tolerance: 20%; Mount: Surface Mount; REACH SVHC: No SVHC; Radiation Hardening: No; Case Code (Metric): 1608
C?#47-C?#49 = CMP-2000-06226-4: Multilayer Ceramic Capacitor 10uF 16V X5R 20% SMD 0603 T/R; Packaging: Tape and Reel; Construction: Flat; Height: 0.8mm; Max Operating Temperature: 85°C; Dielectric: X5R; Case Code (Metric): 1608; Voltage Rating (DC): 16V; Width: 0.031inch; Voltage Rating: 16V; Length: 0.063inch; RoHS Compliant: Yes; Halogen Free: Halogen Free; Case Code (Imperial): 0603; Capacitance: 10uF; Mount: Surface Mount; Thickness: 0.031inch; Tolerance: 20%; Min Operating Temperature: -55°C; Series: M; Termination: SMD/SMT; Case/Package: 0603; Package Quantity: 1
D? = CMP-004-00040-2: Led, Red/Grn, 180Mcd/230Mcd, 624Nm/525Nm Rohs Compliant: Yes; Source: rgled.SchLib; Component Type: Standard; Design Item ID: CMP-004-00034-2; Pins: 4
F?#1-F?#4 = CMP-08606-000067-1: PTC RESET FUSE 13.2V 500MA 1210; Approvals: cULus; Resistance: 900mR; Time to Trip: 0.1s; Max Current Rating: 100A; Trip Current: 1A; Max Power Dissipation: 600mW; Case Code (Metric): 3225; Min Operating Temperature: -40°C; Max Voltage Rating (DC): 13.2V; Hold Current: 500mA; Working Voltage: 13.2V; Termination: SMD/SMT; Case Code (Imperial): 1210; Current Rating: 100A; REACH SVHC: No SVHC; Width: 2.8mm; Lead Free: Lead Free; Length: 3.43mm; Voltage Rating (DC): 13.2V; Packaging: Tape and Reel; Terminal Material: Copper; Voltage Rating: 13.2V; Height: 0.85mm; Case/Package: 1210; Package Quantity: 4000; Max Operating Temperature: 85°C; Power Dissipation: 600mW; Operating Supply Voltage: 13.2V
L?#1 L?#4 L?#7 L?#10 = CMP-0227-00094-3: NexarPartId: 8917123; Current Rating: 1.2A; Shielding: Shielded; Core Material: Ferrite; Inductance: 100µH; Test Frequency: 100kHz; Tolerance: 30%; Resistance: 255mΩ; Self Resonant Frequency: 6MHz; Composition: Wirewound; Packaging: Cut Tape (CT); REACH SVHC: Unknown; Number of Pins: 2; Max DC Current: 1.2A; Saturation Current: 1.2A; Ambient Temperature Range High: 95°C; Weight: 1.273007g; Height: 3.8mm; Width: 10mm; Min Operating Temperature: -40°C; Max Operating Temperature: 125°C; Termination: SMD/SMT; Height - Seated (Max): 4.0894mm; Length: 10mm; RMS Current (Irms): 1.2A; Ambient Temperature Range Low: -40°C; RoHS: Compliant; Mount: Surface Mount; Depth: 10mm; DC Resistance (DCR): 255mΩ; Inductance Tolerance: 30%; Case/Package: Nonstandard
L?#2 L?#5 L?#8 L?#11 = CMP-11268-000041-1: NOT COILCRAFT - ACTUAL P# --> ADL32VHC-220M / - Power Injection Chokes for PoC; Manufacturer Part Number: 1210POC-223MRC; Value: 22uH; Core Material: Ferrite; Saturation Current: 720mA; Series Resistance: 0.88Ω; Rms Current: 700mA; Automotive Grade: Grade 1; Self Resonant Frequency: 70MHz; Test Frequency: 100kHz; Tolerance: 20%; Ambient Temperature Range High: +125°C; Manufacturer: coilcraft; Octopart: https://octopart.com/1210poc-223mrc-coilcraft-103207315; Category: Ind; Device Class L2: Inductors; RoHS: TRUE; Device Class L3: Fixed Inductors; Package: 1210POC; Ambient Temperature Range Low: -40°C; ComponentLink2URL: https://drive.google.com/open?id=15FlOq8Y4YbRFohfA_cJ40jgnqs8va2Mh; Lead Free: Yes; Inductance: 22uH; Device Class L1: Passive Components; ComponentLink2Description: Datasheet; Automotive: Yes; Height: 3mm
L?#3 L?#6 L?#9 L?#12 = CMP-11268-000007-1: Fixed Inductors PFL1609 Low Profile 0.56 uH 20 % 1.4 A; Manufacturer: coilcraft; Rms Current: 1100mA; Self Resonant Frequency: 600MHz; Core Material: Composite; Tolerance: 20%; Value: 0.56uH; Automotive Grade: Grade 1; Saturation Current: 710mA; Test Frequency: 7.9MHz; Shielding: true; Series Resistance: 130mΩ; Lead Free: Yes; Device Class L1: Passive Components; Package: PFL1609; Octopart: https://octopart.com/pfl1609-561mew-coilcraft-20329171; ComponentLink2URL: https://www.coilcraft.com/pdfs/pfl1609.pdf; Manufacturer Part Number: PFL1609-561MEW; Ambient Temperature Range Low: -40°C; Composition: Wirewound; Inductance: 0.56uH; Device Class L2: Inductors; Category: Ind; Device Class L3: Fixed Inductors; Mouser Description: Fixed Inductors PFL1609 Low Profile 0.56 uH 20 % 1.4 A; Automotive: Yes; ComponentLink2Description: Datasheet; Ambient Temperature Range High: +105°C; Height: 0.95mm; RoHS: TRUE
Q?#1 Q?#2 Q?#5-Q?#10 = CMP-2000-04939-1: Dual N & P-Channel 2.5 V Specified PowerTrench(TM) MOSFET, -55 to 150 degC, 6-Pin SOT-23, RoHS, Tape and Reel; Manufacturer: Fairchild; Typical Rise Time: 9@NChannel; Rad Hard: No; Maximum Drain Source Voltage: 20V; Typical Fall Time: 3@NChannel; Typical Turn-On Delay Time: 5@NChannel; Maximum Continuous Drain Current: 2.7@NChannel; Typical Turn-Off Delay Time: 12@NChannel; RDS-on: 80@4.5V@NChannel; Channel Mode: Enhancement; Maximum Gate Source Voltage: ±8V; Package Version: Rev. 5, 05/2015; Operating Temperature: -55to150degC; Packaging: Tape&Reel; Package Reference: SOT23-6; Package URL: https://www.fairchildsemi.com/package-drawings/MA/MA06A.pdf; Package Description: 6-Pin Small Outline Transistor, Body 2.9 x 1.6 mm, Pitch 0.95 mm; Manufacturer URL: https://www.fairchildsemi.com/; Channel Type: N; Datasheet Version: Rev. E, 07/2000; Package: 6SuperSOT; Datasheet URL: https://www.fairchildsemi.com/datasheets/FD/FDC6327C.pdf; Mounting: SurfaceMount; Category: MOSFET
Q?#3 Q?#4 = CMP-1259-00116-1: Dual P-Channel Trench MOSFET, -50 V, -0.16 A, -55 to 150 degC, 6-Pin SOT363, Tape and Reel; Manufacturer: NXP Semiconductors; VGSth [typ] (V): -1.6; Automotive Qualified: Y; Channel Type: P; IDM [max] (A): -0.64; Packing: Tape & Reel; Mounting Technology: Surface Mount; PackageDescription: 6-Pin Small Outline Transistor Package, Body 2 x 1.25 mm, Pitch 0.65 mm; ComponentLink2URL: http://www.nxp.com/documents/data_sheet/BSS84AKS.pdf; ComponentLink3URL: http://www.nxp.com/documents/outline_drawing/sot363_po.pdf; PartNumber: BSS84AKS,115; PackageReference: SOT363; PackageVersion: 06-03-16, 03/2006; ComponentLink3Description: Package Specification; ComponentLink2Description: Datasheet; ComponentLink1Description: Manufacturer URL; VDS [max] (V): -50; Code_JEITA: SC-88; ID [max] (A): -0.16; DatasheetVersion: Rev. 1; ComponentLink1URL: http://www.nxp.com/
R?#1 R?#13 R?#24 R?#31 = CMP-009-00002-14: Value: 100k
R?#2-R?#12 R?#14-R?#23 R?#25-R?#30 R?#32-R?#47 = CMP-009-00002-14: Resistor
  R?#3 R?#8 R?#15 R?#23 R?#25 R?#29 R?#32 R?#36 R?#44 R?#46: Value: 100k
  R?#11 R?#12: Value: 1k
  R?#38-R?#43 R?#45 R?#47: Value: 0
R?#48 = CMP-009-00002-14: Resistor; Value: 100k
U?#1 U?#4 = CMP-015-00011-4: Quad Tunneling GMSL2/1 to CSI-2 Deserializer
U?#2 = CMP-0244-00308-1: Fixed Low Drop Positive Voltage Regulator, 1.8V, 4-Pin SOT-223, Tape and Reel; ComponentLink1URL: http://www.st.com; PackageReference: SOT-223; PackageDescription: 4-Pin SOT-223 Package, 6.5 x 3.5 mm Body, 2.3 mm Pitch, 7 mm Lead Span; ComponentLink2URL: http://www.st.com/internet/com/TECHNICAL_RESOURCES/TECHNICAL_LITERATURE/DATASHEET/CD00000544.pdf; ComponentLink2Description: Datasheet; ComponentLink1Description: Manufacturer URL; DatasheetVersion: 1/11/2011; PackageVersion: 2010
U?#3 = CMP-0244-00318-1: Fixed Low Drop Positive Voltage Regulator, 1.2V, 4-Pin SOT-223, Tape and Reel; PackageDescription: 4-Pin SOT-223 Package, 6.5 x 3.5 mm Body, 2.3 mm Pitch, 7 mm Lead Span; PackageVersion: 2010; ComponentLink2Description: Datasheet; PackageReference: SOT-223; ComponentLink2URL: http://www.st.com/internet/com/TECHNICAL_RESOURCES/TECHNICAL_LITERATURE/DATASHEET/CD00000544.pdf; ComponentLink1Description: Manufacturer URL; DatasheetVersion: 1/11/2011; ComponentLink1URL: http://www.st.com
U?#5 = CMP-06317-000025-1: QUAD HIGH-SIDE CURRENT SENSOR; Accuracy: 1%; Min Operating Temperature: -40°C; Mount: Surface Mount; Max Operating Temperature: 85°C; Packaging: Cut Tape; RoHS Compliant: No
Y? = CMP-2000-05733-3: Crystal 25MHz ±20ppm (Tol) ±30ppm (Stability) 18pF FUND 60Ω 4-Pin SMD T/R; Series Resistance: 60R; Length: 3.2mm; Depth: 2.5mm; Packaging: Tape and Reel; Min Operating Temperature: -40°C; Operating Frequency: 25 MHz; Lead Free: Lead Free; Number of Pins: 4; Frequency Tolerance: 20ppm; Radiation Hardening: No; Max Operating Temperature: 85°C; Termination: SMD/SMT; Frequency Stability: 30ppm; Frequency: 25MHz; Series: ABM8G; Mount: Surface Mount; Package Quantity: 1000; Height: 0.039inch; Width: 0.098inch; Case/Package: CSMD; ESR (Equivalent Series Resistance): 60R; Load Capacitance: 18pF; Tolerance: 20ppm